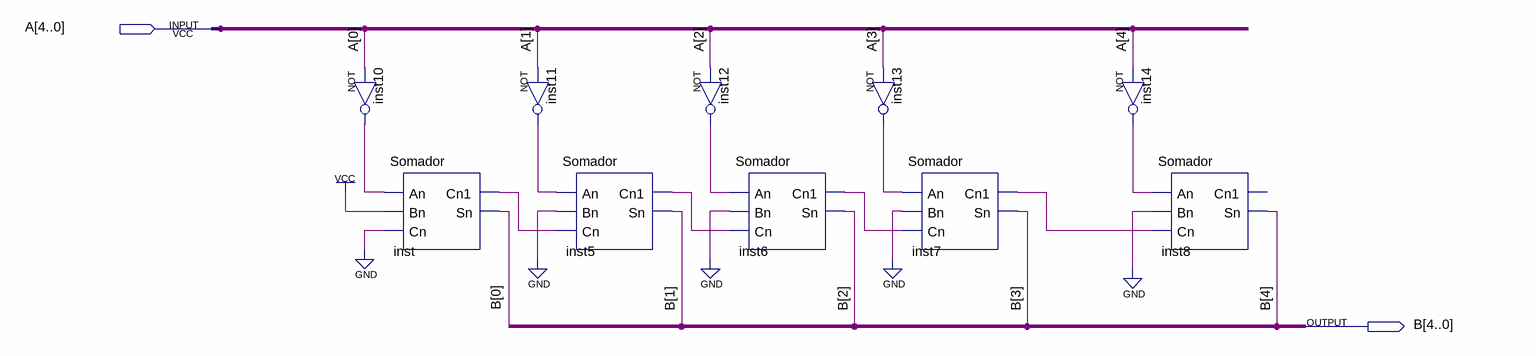
[diagram p0: schematic sheet]
// Quartus schematic Comp2.bdf as structural Verilog: 10 symbols, 2 pins
module Comp2 (
  input  [4:0] A,
  output [4:0] B
);

  wire inst5_cn1, inst6_cn1, inst7_cn1, inst10_out, inst11_out, inst12_out, inst13_out, inst14_out, inst_cn1;

  not inst10 (inst10_out, A[0]);
  Somador inst (.An(inst10_out), .Bn(1'b1), .Cn(1'b0), .Cn1(inst_cn1), .Sn(B[0]));
  not inst11 (inst11_out, A[1]);
  Somador inst5 (.An(inst11_out), .Bn(1'b0), .Cn(inst_cn1), .Cn1(inst5_cn1), .Sn(B[1]));
  not inst12 (inst12_out, A[2]);
  Somador inst6 (.An(inst12_out), .Bn(1'b0), .Cn(inst5_cn1), .Cn1(inst6_cn1), .Sn(B[2]));
  not inst13 (inst13_out, A[3]);
  Somador inst7 (.An(inst13_out), .Bn(1'b0), .Cn(inst6_cn1), .Cn1(inst7_cn1), .Sn(B[3]));
  not inst14 (inst14_out, A[4]);
  Somador inst8 (.An(inst14_out), .Bn(1'b0), .Cn(inst7_cn1), .Sn(B[4]));  // open: Cn1
endmodule
